# Altium schematic sheet C52.SchDoc
size A4
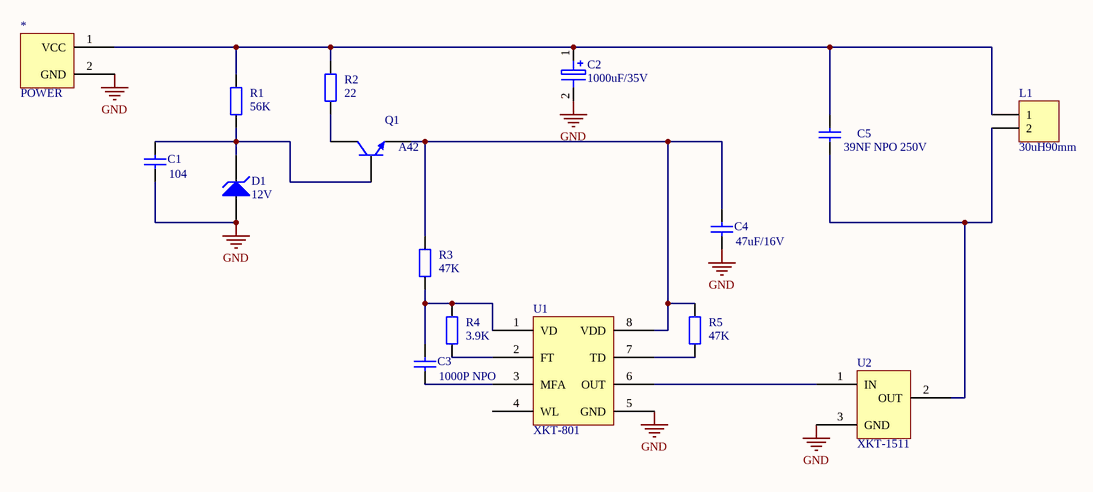
[diagram p0: C52.SchDoc]

## Parts
*  POWER  [POWER]
C1  value 104  [RAD-0.3]  (hidden comment: Cap)
C2  1000uF/35V  [C2]
C3  value 1000P NPO  [RAD-0.3]  (hidden comment: Cap)
C4  value 47uF/16V  [RAD-0.3]  (hidden comment: Cap)
C5  value 39NF NPO 250V  [RAD-0.3]  (hidden comment: Cap)
D1  12V  [DIODE-0.7]
L1  30uH90mm  [HDR1X2]
Q1  A42  [TO-226-AA]
R1  value 56K  [AXIAL-0.4]  (hidden comment: Res2)
R2  value 22  [AXIAL-0.4]  (hidden comment: Res2)
R3  value 47K  [AXIAL-0.4]  (hidden comment: Res2)
R4  value 3.9K  [AXIAL-0.4]  (hidden comment: Res2)
R5  value 47K  [AXIAL-0.4]  (hidden comment: Res2)
U1  XKT-801  [XKT-801 - duplicate1]
U2  XKT-1511  [XKT-1511]

## Nets
GND: *.2(GND) C1.1 C2.2(E) C4.1 D1.1(A) U1.5(GND) U2.3(GND)
Net*_1: *.1(VCC) C2.1 C5.2 L1.1 R1.2 R2.2
NetC1_2: C1.2 D1.2(K) Q1.2(B) R1.1
NetC3_1: C3.1 U1.3(MFA)
NetC3_2: C3.2 R3.1 R4.2 U1.1(VD)
NetC4_2: C4.2 Q1.3(E) R3.2 R5.2 U1.8(VDD)
NetC5_1: C5.1 L1.2 U2.2(OUT)
NetQ1_1: Q1.1(C) R2.1
NetR4_1: R4.1 U1.2(FT)
NetR5_1: R5.1 U1.7(TD)
NetU1_6: U1.6(OUT) U2.1(IN)

Not connected (* = marked no-connect by the designer): U1 4(WL)

## Library data of the parts
C1 C3-C5 = Cap: Capacitor; Published: 8-Jun-2000; LatestRevisionDate: 17-Jul-2002; LatestRevisionNote: Re-released for DXP Platform.; PackageReference: RAD-0.3; Publisher: Altium Limited; PackageDescription: Radial Cap, Thru-Hole; 2 Leads; 0.3 in Pin Spacing
C2 = C2
D1 = D Zener: Zener Diode; Published: 8-Jun-2000; LatestRevisionDate: 17-Jul-2002; LatestRevisionNote: Re-released for DXP Platform.; PackageReference: DIODE-0.7; Publisher: Altium Limited; PackageDescription: Diode, Thru-Hole; 2 Leads; 0.7 in Pin Spacing
L1 = Header 2: Header, 2-Pin; LatestRevisionDate: 17-Jul-2002; LatestRevisionNote: Re-released for DXP Platform.; Publisher: Altium Limited
Q1 = NPN: NPN Bipolar Transistor; Published: 8-Jun-2000; LatestRevisionDate: 17-Jul-2002; LatestRevisionNote: Re-released for DXP Platform.; PackageReference: TO-226-AA; Publisher: Altium Limited; PackageDescription: TO, Flat Index; 3 In-Line, Axial Leads; Body Dia. 4.8mm; Leads 0.55 x 0.51 mm (max); Code_JEDEC: TO-226-AA
R1-R5 = Res2: Resistor; Published: 8-Jun-2000; LatestRevisionDate: 17-Jul-2002; LatestRevisionNote: Re-released for DXP Platform.; PackageReference: AXIAL-0.4; Publisher: Altium Limited; PackageDescription: Axial Device, Thru-Hole; 2 Leads; 0.4 in Pin Spacing